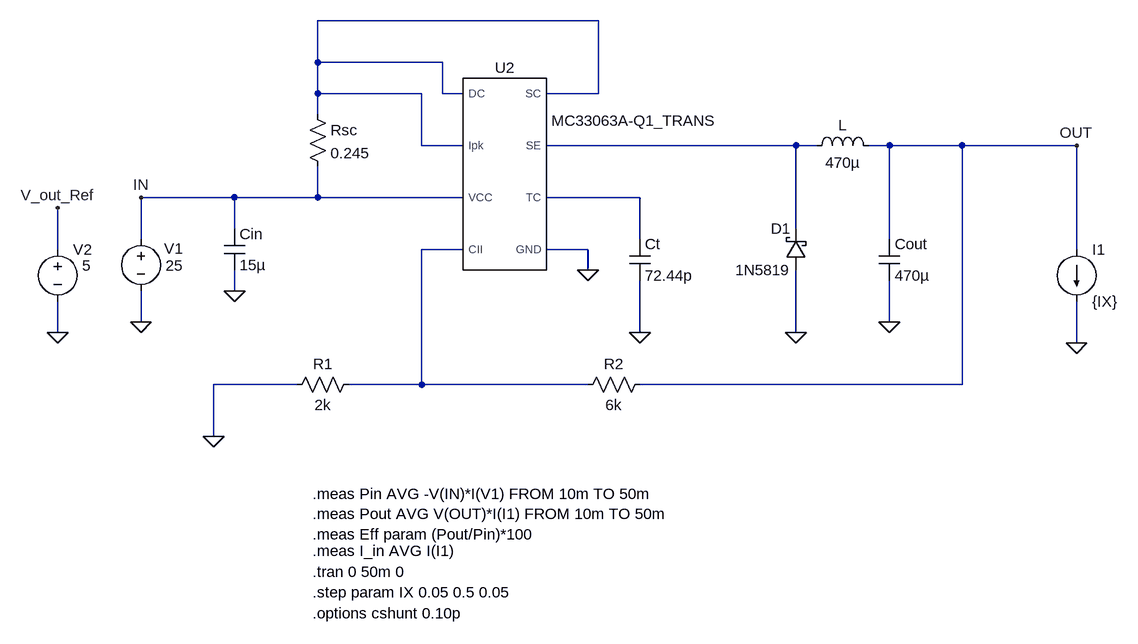
[diagram p0: schematic DC_DC_Converter_5V.asc]
DC_DC_Converter_5V.asc, the LTspice schematic file:
Version 4
SHEET 1 1712 1760
WIRE -480 832 -912 832
WIRE -912 896 -912 832
WIRE -720 896 -912 896
WIRE -912 944 -912 896
WIRE -752 944 -912 944
WIRE -720 944 -720 896
WIRE -688 944 -720 944
WIRE -480 944 -480 832
WIRE -480 944 -560 944
WIRE -912 976 -912 944
WIRE -752 1024 -752 944
WIRE -688 1024 -752 1024
WIRE -176 1024 -560 1024
WIRE -144 1024 -176 1024
WIRE -32 1024 -64 1024
WIRE 80 1024 -32 1024
WIRE 256 1024 80 1024
WIRE -1040 1104 -1184 1104
WIRE -912 1104 -912 1056
WIRE -912 1104 -1040 1104
WIRE -688 1104 -912 1104
WIRE -416 1104 -560 1104
WIRE -1040 1152 -1040 1104
WIRE -176 1152 -176 1024
WIRE -1184 1168 -1184 1104
WIRE -416 1168 -416 1104
WIRE -32 1168 -32 1024
WIRE -1312 1184 -1312 1120
WIRE -688 1184 -752 1184
WIRE -496 1184 -560 1184
WIRE 256 1184 256 1024
WIRE -496 1216 -496 1184
WIRE -1040 1248 -1040 1216
WIRE -1184 1296 -1184 1248
WIRE -32 1296 -32 1232
WIRE -1312 1312 -1312 1264
WIRE -416 1312 -416 1232
WIRE -176 1312 -176 1216
WIRE 256 1328 256 1264
WIRE -944 1392 -1072 1392
WIRE -752 1392 -752 1184
WIRE -752 1392 -864 1392
WIRE -496 1392 -752 1392
WIRE 80 1392 80 1024
WIRE 80 1392 -416 1392
WIRE -1072 1472 -1072 1392
FLAG -1184 1296 0
FLAG -32 1296 0
FLAG -1040 1248 0
FLAG -176 1312 0
FLAG -416 1312 0
FLAG -496 1216 0
FLAG -1072 1472 0
FLAG 256 1024 OUT
FLAG 256 1328 0
FLAG -1184 1104 IN
FLAG -1312 1312 0
FLAG -1312 1120 V_out_Ref
SYMBOL voltage -1184 1152 R0
WINDOW 123 0 0 Left 0
WINDOW 39 0 0 Left 0
WINDOW 3 65 57 Right 2
WINDOW 0 36 31 Left 2
SYMATTR Value 25
SYMATTR InstName V1
SYMBOL MC33063A-Q1_TRANS -624 992 R0
WINDOW 3 200 -22 Top 2
SYMATTR InstName U2
SYMBOL res -928 960 R0
SYMATTR InstName Rsc
SYMATTR Value 0.245
SYMBOL schottky -160 1216 R180
WINDOW 0 24 64 Left 2
WINDOW 3 24 0 Left 2
SYMATTR InstName D1
SYMATTR Value 1N5819
SYMATTR Description Diode
SYMATTR Type diode
SYMBOL cap -432 1168 R0
SYMATTR InstName Ct
SYMATTR Value 72.44p
SYMBOL ind -160 1040 R270
WINDOW 0 32 56 VTop 2
WINDOW 3 5 56 VBottom 2
SYMATTR InstName L
SYMATTR Value 470µ
SYMBOL cap -48 1168 R0
SYMATTR InstName Cout
SYMATTR Value 470µ
SYMBOL res -400 1376 R90
WINDOW 0 0 56 VBottom 2
WINDOW 3 32 56 VTop 2
SYMATTR InstName R2
SYMATTR Value 6k
SYMBOL res -960 1408 R270
WINDOW 0 32 56 VTop 2
WINDOW 3 0 56 VBottom 2
SYMATTR InstName R1
SYMATTR Value 2k
SYMBOL cap -1056 1152 R0
SYMATTR InstName Cin
SYMATTR Value 15µ
SYMBOL load2 256 1184 R0
SYMATTR InstName I1
SYMATTR Value {IX}
SYMBOL voltage -1312 1168 R0
WINDOW 123 0 0 Left 0
WINDOW 39 0 0 Left 0
WINDOW 3 51 41 Right 2
SYMATTR Value 5
SYMATTR InstName V2
TEXT -920 1680 Left 2 !.tran 0 50m 0
TEXT -920 1560 Left 2 !.meas Pin AVG -V(IN)*I(V1) FROM 10m TO 50m\n.meas Pout AVG V(OUT)*I(I1) FROM 10m TO 50m\n.meas Eff param (Pout/Pin)*100
TEXT -920 1712 Left 2 !.step param IX 0.05 0.5 0.05
TEXT -920 1744 Left 2 !.options cshunt 0.10p
TEXT -920 1648 Left 2 !.meas I_in AVG I(I1)

The netlist it stands for:
* DC_DC_Converter_5V.asc
V1 IN 0 25
XU2 N004 N001 0 N001 N001 N002 N003 IN MC33063A-Q1_TRANS  ; pins CII DC GND Ipk SC SE TC VCC
Rsc N001 IN 0.245
D1 0 N002 1N5819
Ct N003 0 72.44p
L N002 OUT 470µ
Cout OUT 0 470µ
R2 OUT N004 6k
R1 0 N004 2k
Cin IN 0 15µ
I1 OUT 0 {IX}
V2 V_out_Ref 0 5
.model D D
.lib standard.dio
.tran 0 50m 0
.meas Pin AVG -V(IN)*I(V1) FROM 10m TO 50m
.meas Pout AVG V(OUT)*I(I1) FROM 10m TO 50m
.meas Eff param (Pout/Pin)*100
.step param IX 0.05 0.5 0.05
.options cshunt 0.10p
.meas I_in AVG I(I1)
.lib C:\Users\kunal\Downloads\sllm444\MC33063A-Q1_PSPICE_TRANS\MC33063A-Q1_TRANS.lib
.backanno
.end